# Altium schematic sheet Sheet1.SchDoc
size A4
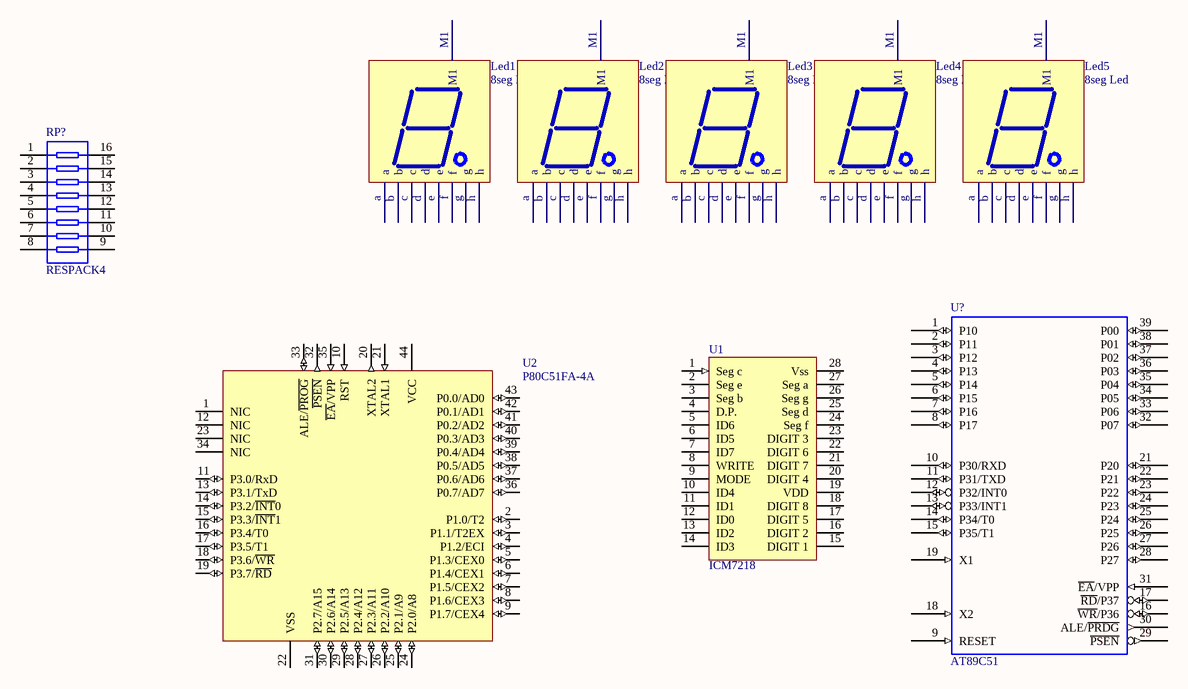
[diagram p0: Sheet1.SchDoc]

## Parts
Led1  8seg Led
Led2  8seg Led
Led3  8seg Led
Led4  8seg Led
Led5  8seg Led
RP?  RESPACK4  [DIP16]
U1  ICM7218
U2  P80C51FA-4A  [SOT187-2_N]
U?  AT89C51  [DIP-40]

## Nets
GND: U?.20(GND)
VCC: U?.40(VCC)

Not connected (* = marked no-connect by the designer): Led1 a b c d e f g h M1; Led2 a b c d e f g h M1; Led3 a b c d e f g h M1; Led4 a b c d e f g h M1; Led5 a b c d e f g h M1; RP? 1 2 3 4 5 6 7 8 9 10 11 12 13 14 15 16; U1 1(Seg_c) 2(Seg_e) 3(Seg_b) 4(D.P.) 5(ID6) 6(ID5) 7(ID7) 8(WRITE) 9(MODE) 10(ID4) 11(ID1) 12(ID0) 13(ID2) 14(ID3) 15(DIGIT_1) 16(DIGIT_2) 17(DIGIT_5) 18(DIGIT_8) 19(VDD) 20(DIGIT_4) 21(DIGIT_7) 22(DIGIT_6) 23(DIGIT_3) 24(Seg_f) 25(Seg_d) 26(Seg_g) 27(Seg_a) 28(Vss); U2 1(NIC) 2(P1.0/T2) 3(P1.1/T2EX) 4(P1.2/ECI) 5(P1.3/CEX0) 6(P1.4/CEX1) 7(P1.5/CEX2) 8(P1.6/CEX3) 9(P1.7/CEX4) 10(RST) 11(P3.0/RxD) 12(NIC) 13(P3.1/TxD) 14(P3.2/~{INT}0) 15(P3.3/~{INT}1) 16(P3.4/T0) 17(P3.5/T1) 18(P3.6/~{WR}) 19(P3.7/~{RD}) 20(XTAL2) 21(XTAL1) 22(VSS) 23(NIC) 24(P2.0/A8) 25(P2.1/A9) 26(P2.2/A10) 27(P2.3/A11) 28(P2.4/A12) 29(P2.5/A13) 30(P2.6/A14) 31(P2.7/A15) 32(~{PSEN}) 33(ALE/~{PROG}) 34(NIC) 35(~{EA}/VPP) 36(P0.7/AD7) 37(P0.6/AD6) 38(P0.5/AD5) 39(P0.4/AD4) 40(P0.3/AD3) 41(P0.2/AD2) 42(P0.1/AD1) 43(P0.0/AD0) 44(VCC); U? 1(P10) 2(P11) 3(P12) 4(P13) 5(P14) 6(P15) 7(P16) 8(P17) 9(RESET) 10(P30/RXD) 11(P31/TXD) 12(P32/INT0) 13(P33/INT1) 14(P34/T0) 15(P35/T1) 16(~{WR}/P36) 17(~{RD}/P37) 18(X2) 19(X1) 21(P20) 22(P21) 23(P22) 24(P23) 25(P24) 26(P25) 27(P26) 28(P27) 29(~{PSEN}) 30(ALE/~{PRDG}) 31(~{EA}/VPP) 32(P07) 33(P06) 34(P05) 35(P04) 36(P03) 37(P02) 38(P01) 39(P00)

## Library data of the parts
RP? = 8单路阻排
U2 = P80C51FA-4A: 80C51 8-Bit Microcontroller Family: 128 B RAM, ROMless, 2.7V-5.5V, Low Power, High Speed; Published: 21-May-2003; LatestRevisionDate: 13-Apr-2006; LatestRevisionNote: IPC-7351 Footprint Added.; DatasheetVersion: 7-Aug-2000; PackageVersion: Jan-2000; PackageReference: SOT187-2; Publisher: Altium Limited; PackageDescription: 44-Pin Leaded Chip Carrier 1.27 mm Pitch; Code_JEDEC: MO-047AC; Code_IPC: PLCC-44; ComponentLink1Description: Manufacturer Link; ComponentLink1URL: http://www-us2.semiconductors.philips.com/; ComponentLink2Description: Datasheet; ComponentLink2URL: http://www.semiconductors.philips.com/acrobat/datasheets/89C51_89C52_89C54_89C58_10.pdf; ComponentLink3Description: Discontinuation Notice; ComponentLink3URL: http://www.semiconductors.philips.com/pip/old/89c51_89c52_89c54_89c58_10.html